# EAGLE design Sensor Board (EAGLE 6.4)

## Sheet 1 of 5: Microcontroller
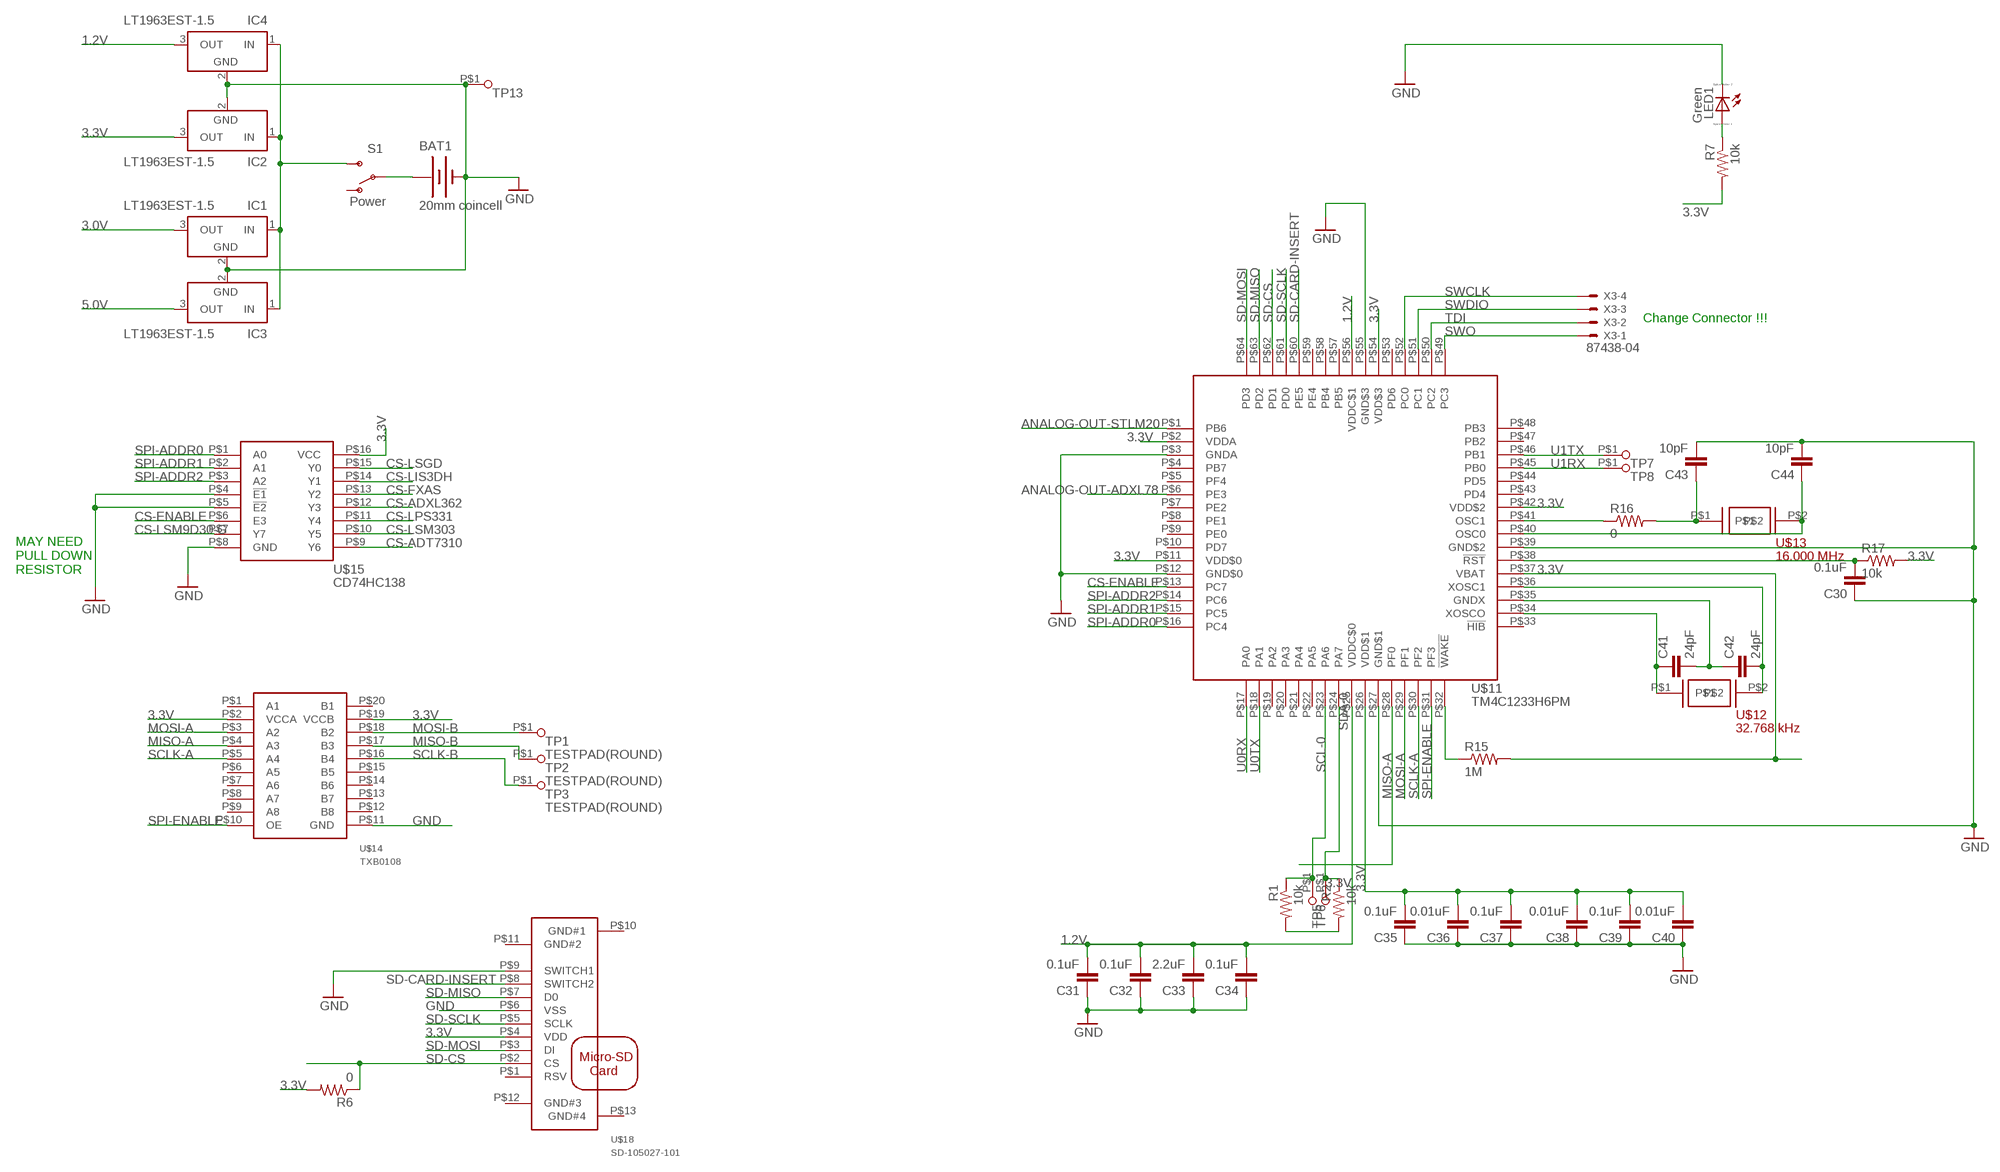
[diagram p0: schematic, sheet 1]

### Parts
BAT1  20mm coincell  BATTERY20MM_4LEGS  [BATTCON_20MM_4LEGS]
C30  0.1uF  CAP0603-CAP  [0603-CAP]
C31  0.1uF  CAP0603-CAP  [0603-CAP]
C32  0.1uF  CAP0603-CAP  [0603-CAP]
C33  2.2uF  CAP0603-CAP  [0603-CAP]
C34  0.1uF  CAP0603-CAP  [0603-CAP]
C35  0.1uF  CAP0603-CAP  [0603-CAP]
C36  0.01uF  CAP0603-CAP  [0603-CAP]
C37  0.1uF  CAP0603-CAP  [0603-CAP]
C38  0.01uF  CAP0603-CAP  [0603-CAP]
C39  0.1uF  CAP0603-CAP  [0603-CAP]
C40  0.01uF  CAP0603-CAP  [0603-CAP]
C41  24pF  CAP0603-CAP  [0603-CAP]
C42  24pF  CAP0603-CAP  [0603-CAP]
C43  10pF  CAP0603-CAP  [0603-CAP]
C44  10pF  CAP0603-CAP  [0603-CAP]
IC1  LT1963EST-1.5  [SOT223]
IC2  LT1963EST-1.5  [SOT223]
IC3  LT1963EST-1.5  [SOT223]
IC4  LT1963EST-1.5  [SOT223]
LED1  Green  LED_ESML0603  [LED_SML0603]
R1  10k  RESISTOR0603-RES  [0603-RES]
R2  10k  RESISTOR0603-RES  [0603-RES]
R6  0  RESISTOR0603-RES  [0603-RES]
R7  10k  RESISTOR0603-RES  [0603-RES]
R15  1M  RESISTOR0603-RES  [0603-RES]
R16  0  RESISTOR0603-RES  [0603-RES]
R17  10k  RESISTOR0603-RES  [0603-RES]
S1  Power  SWITCH-SPDT-SMD-A  [SWITCH-SPST-SMD-A]
TP1  TESTPAD(ROUND)  [TESTPAD(ROUND)]
TP2  TESTPAD(ROUND)  [TESTPAD(ROUND)]
TP3  TESTPAD(ROUND)  [TESTPAD(ROUND)]
TP5  TESTPAD(ROUND)  [TESTPAD(ROUND)]
TP6  TESTPAD(ROUND)  [TESTPAD(ROUND)]
TP7  TESTPAD(ROUND)  [TESTPAD(ROUND)]
TP8  TESTPAD(ROUND)  [TESTPAD(ROUND)]
TP13  TESTPAD(ROUND)  [TESTPAD(ROUND)]
U$11  TM4C1233H6PM  [S-PQFP-G64]
U$12  32.768 kHz  AB26TRB  [CYLINDRICAL-(1.9DIAX6L)]
U$13  16.000 MHz  NX5032GA  [2-SMD]
U$14  TXB0108  [TSSOP-(PW)-20]
U$15  CD74HC138  [SOIC-16]
U$18  SD-105027-101  [SD-105027-101]
X3  87438-04  [87438-04]

### Nets
1.2V: C31.2 C32.2 C33.2 C34.2 IC4.3(OUT) U$11.P$25(VDDC$0) U$11.P$56(VDDC$1)
3.0V: IC1.3(OUT) ; also sheet 2
3.3V: C35.2 C36.2 C37.2 C38.2 C39.2 C40.2 IC2.3(OUT) R1.2 R2.2 R6.2 R7.2 R15.2 R17.2 U$11.P$2(VDDA) U$11.P$11(VDD$0) U$11.P$26(VDD$1) U$11.P$37(VBAT) U$11.P$42(VDD$2) U$11.P$54(VDD$3) U$14.P$2(VCCA) U$14.P$19(VCCB) U$15.P$16(VCC) U$18.P$4(VDD) ; also sheet 2,3,4,5
5.0V: IC3.3(OUT) ; also sheet 5
ANALOG-OUT-ADXL78: U$11.P$6(PE3) ; also sheet 5
ANALOG-OUT-STLM20: U$11.P$1(PB6) ; also sheet 5
CS-ADT7310: U$15.P$9(Y6) ; also sheet 3
CS-ADXL362: U$15.P$12(Y3) ; also sheet 3
CS-ENABLE: U$11.P$13(PC7) U$15.P$6(E3)
CS-FXAS: U$15.P$13(Y2) ; also sheet 4
CS-LIS3DH: U$15.P$14(Y1) ; also sheet 2
CS-LPS331: U$15.P$11(Y4) ; also sheet 2
CS-LSGD: U$15.P$15(Y0) ; also sheet 2
CS-LSM9D30-G: U$15.P$7(Y7) ; also sheet 2
CS-LSM303: U$15.P$10(Y5) ; also sheet 2
GND: BAT1.2(-) C30.1 C31.1 C32.1 C33.1 C34.1 C35.1 C36.1 C37.1 C38.1 C39.1 C40.1 C43.2 C44.2 IC1.2(GND) IC2.2(GND) IC3.2(GND) IC4.2(GND) LED1.C TP13.P$1 U$11.P$3(GNDA) U$11.P$12(GND$0) U$11.P$27(GND$1) U$11.P$39(GND$2) U$11.P$55(GND$3) U$14.P$11(GND) U$15.P$4(!E1) U$15.P$5(!E2) U$15.P$8(GND) U$18.P$6(VSS) U$18.P$9(SWITCH1) ; also sheet 2,3,4,5
MISO-A: U$11.P$28(PF0) U$14.P$4(A3)
MISO-B: TP2.P$1 U$14.P$17(B3) ; also sheet 2,3,4
MOSI-A: U$11.P$29(PF1) U$14.P$3(A2)
MOSI-B: TP1.P$1 U$14.P$18(B2) ; also sheet 2,3,4
N$10: C30.2 R17.1 U$11.P$38(!RST)
N$11: C42.2 U$11.P$36(XOSC1) U$12.P$2
N$12: C41.1 U$11.P$34(XOSCO) U$12.P$1
N$13: C41.2 C42.1 U$11.P$35(GNDX)
N$14: C43.1 R16.2 U$13.P$1
N$16: C44.1 U$11.P$40(OSC0) U$13.P$2
N$17: R16.1 U$11.P$41(OSC1)
N$18: R15.1 U$11.P$32(!WAKE)
N$19: BAT1.1(+) S1.2(P)
N$23: IC1.1(IN) IC2.1(IN) IC3.1(IN) IC4.1(IN) S1.3(S)
N$27: LED1.A R7.1
SCL-0: R1.1 TP6.P$1 U$11.P$23(PA6) ; also sheet 4
SCLK-A: U$11.P$30(PF2) U$14.P$5(A4)
SCLK-B: TP3.P$1 U$14.P$16(B4) ; also sheet 2,3,4
SD-CARD-INSERT: U$11.P$60(PE5) U$18.P$8(SWITCH2)
SD-CS: R6.1 U$11.P$62(PD1) U$18.P$2(CS)
SD-MISO: U$11.P$63(PD2) U$18.P$7(D0)
SD-MOSI: U$11.P$64(PD3) U$18.P$3(DI)
SD-SCLK: U$11.P$61(PD0) U$18.P$5(SCLK)
SDA-0: R2.1 TP5.P$1 U$11.P$24(PA7) ; also sheet 4
SPI-ADDR0: U$11.P$16(PC4) U$15.P$1(A0)
SPI-ADDR1: U$11.P$15(PC5) U$15.P$2(A1)
SPI-ADDR2: U$11.P$14(PC6) U$15.P$3(A2)
SPI-ENABLE: U$11.P$31(PF3) U$14.P$10(OE)
SWCLK: U$11.P$52(PC0) X3.4
SWDIO: U$11.P$51(PC1) X3.3
SWO: U$11.P$49(PC3) X3.1
TDI: U$11.P$50(PC2) X3.2
U0RX: U$11.P$17(PA0)
U0TX: U$11.P$18(PA1)
U1RX: TP8.P$1 U$11.P$45(PB0)
U1TX: TP7.P$1 U$11.P$46(PB1)
Unconnected: S1.1(O) U$11.P$4(PB7) U$11.P$5(PF4) U$11.P$7(PE2) U$11.P$8(PE1) U$11.P$9(PE0) U$11.P$10(PD7) U$11.P$19(PA2) U$11.P$20(PA3) U$11.P$21(PA4) U$11.P$22(PA5) U$11.P$33(!HIB) U$11.P$43(PD4) U$11.P$44(PD5) U$11.P$47(PB2) U$11.P$48(PB3) U$11.P$53(PD6) U$11.P$57(PB5) U$11.P$58(PB4) U$11.P$59(PE4) U$14.P$1(A1) U$14.P$6(A5) U$14.P$7(A6) U$14.P$8(A7) U$14.P$9(A8) U$14.P$12(B8) U$14.P$13(B7) U$14.P$14(B6) U$14.P$15(B5) U$14.P$20(B1) U$18.P$1(RSV) U$18.P$10(GND#1) U$18.P$11(GND#2) U$18.P$12(GND#3) U$18.P$13(GND#4)

### Notes on the sheet
- Change Connector !!!
- MAY NEED
  PULL DOWN
  RESISTOR

## Sheet 2 of 5: STM - Sensors
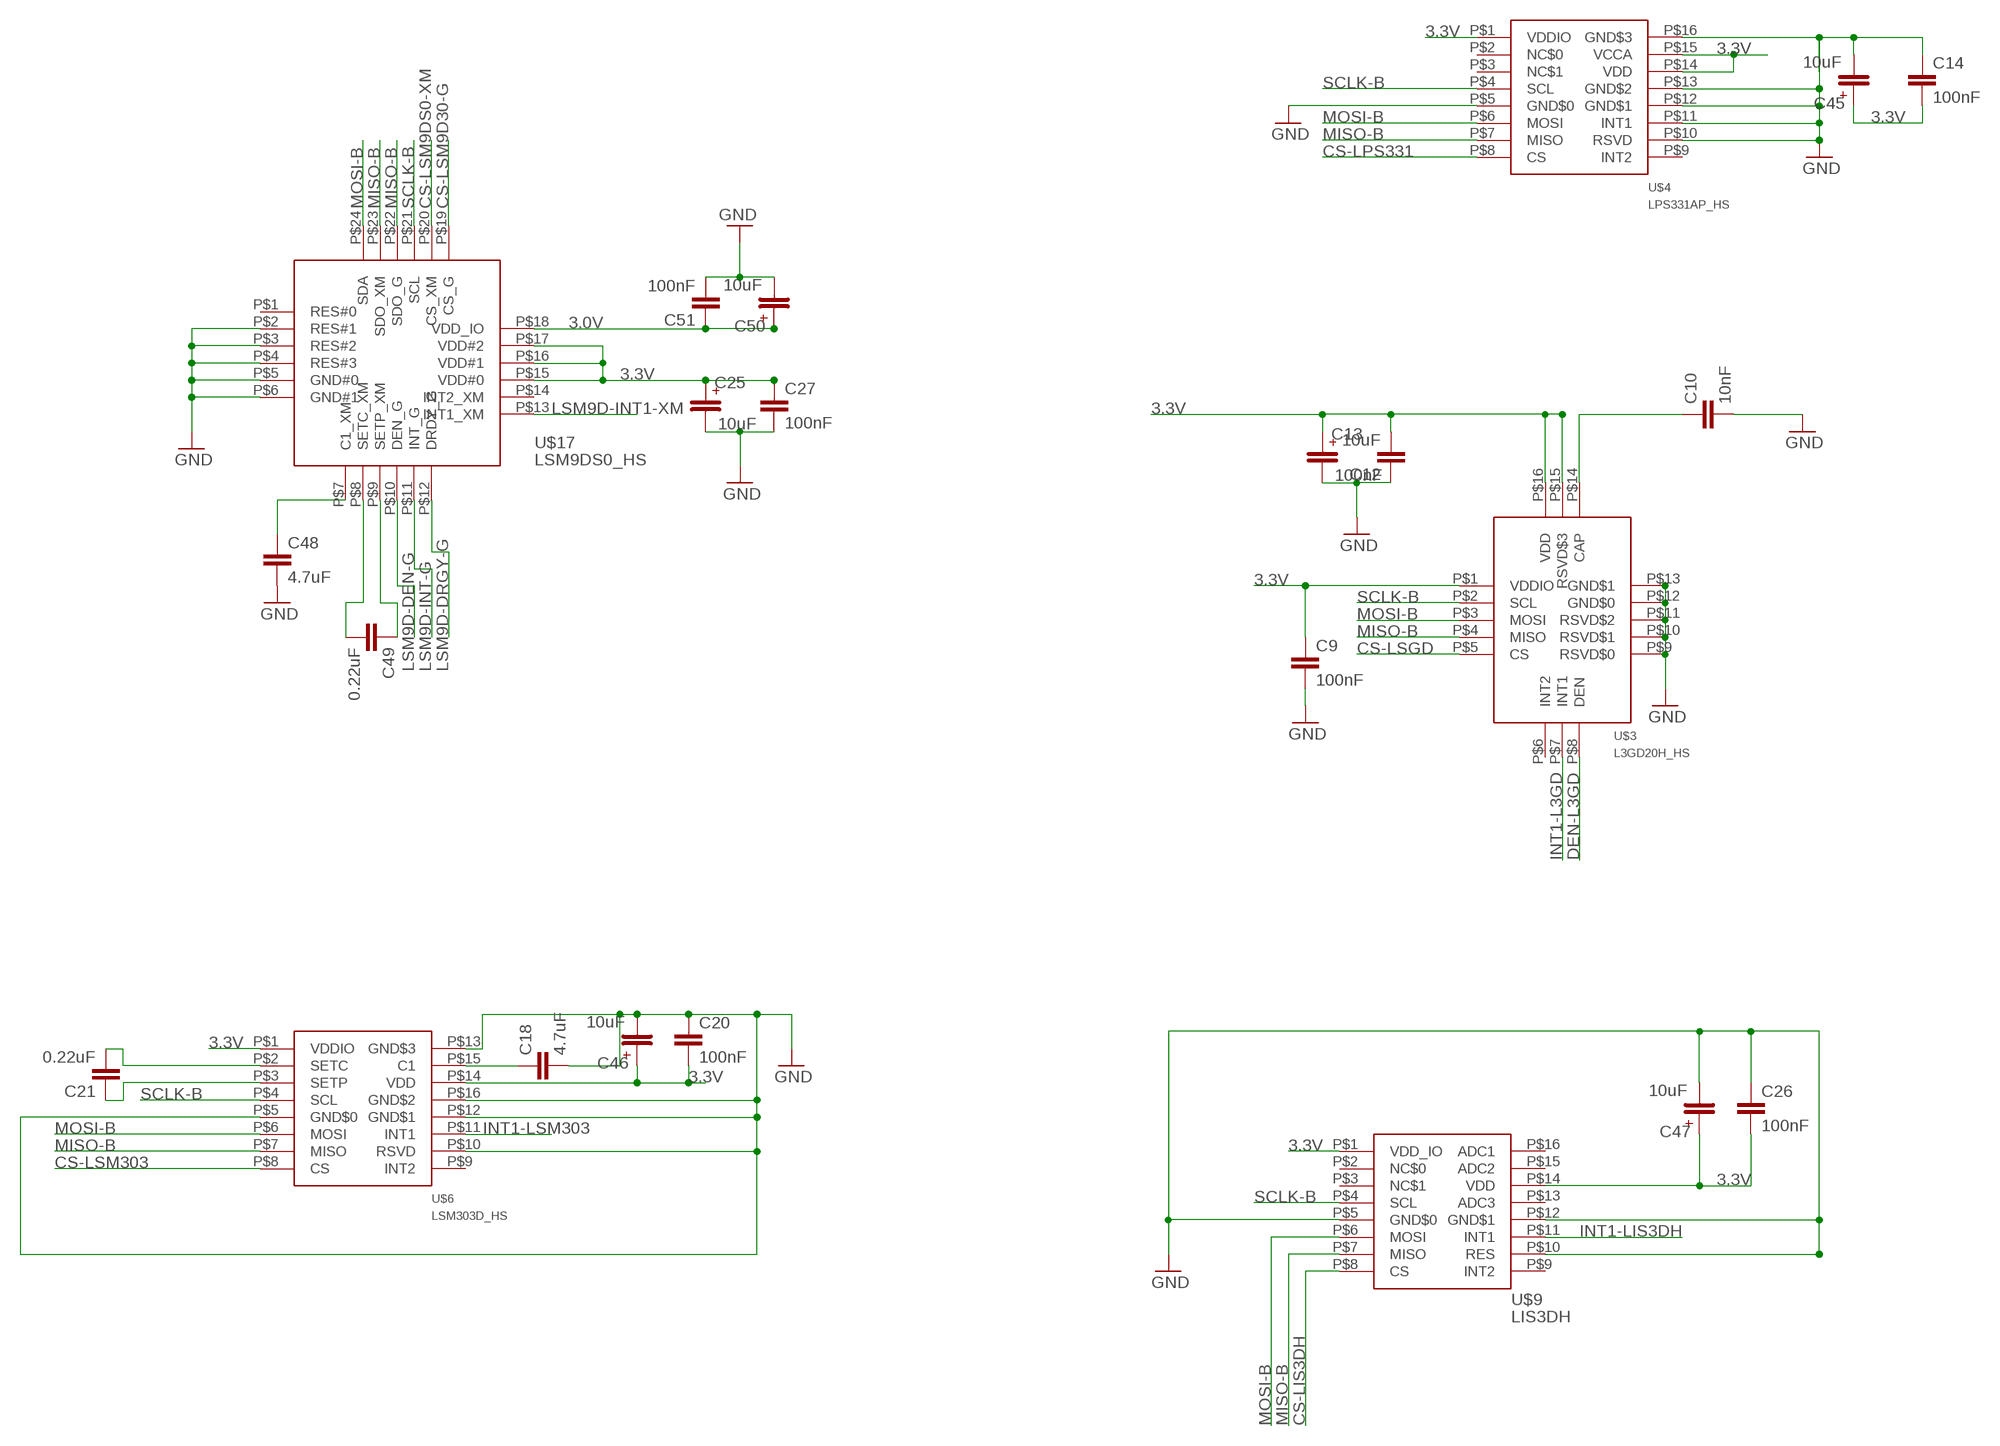
[diagram p1: schematic, sheet 2]

### Parts
C9  100nF  CAP0603-CAP  [0603-CAP]
C10  10nF  CAP0603-CAP  [0603-CAP]
C12  10uF  CAP0603-CAP  [0603-CAP]
C13  100nF  EEFCD0J100ER  [4.3X7.3SMD]
C14  100nF  CAP0603-CAP  [0603-CAP]
C18  4.7uF  CAP0603-CAP  [0603-CAP]
C20  100nF  CAP0603-CAP  [0603-CAP]
C21  0.22uF  CAP0603-CAP  [0603-CAP]
C25  10uF  EEFCD0J100ER  [4.3X7.3SMD]
C26  100nF  CAP0603-CAP  [0603-CAP]
C27  100nF  CAP0603-CAP  [0603-CAP]
C45  10uF  EEFCD0J100ER  [4.3X7.3SMD]
C46  10uF  EEFCD0J100ER  [4.3X7.3SMD]
C47  10uF  EEFCD0J100ER  [4.3X7.3SMD]
C48  4.7uF  CAP0603-CAP  [0603-CAP]
C49  0.22uF  CAP0603-CAP  [0603-CAP]
C50  10uF  EEFCD0J100ER  [4.3X7.3SMD]
C51  100nF  CAP0603-CAP  [0603-CAP]
U$3  L3GD20H_HS  [LGA-16(3X3)_HS]
U$4  LPS331AP_HS  [LGA-16(3X3)_HS]
U$6  LSM303D_HS  [LGA-16(3X3)_HS]
U$9  LIS3DH  LIS3DH_HS  [LGA-16(3X3)_HS]
U$17  LSM9DS0_HS  [LGA-24(4X4)_HS]

### Nets
3.0V: C50.P$1 C51.1 U$17.P$18(VDD_IO) ; also sheet 1
3.3V: C9.1 C12.2 C13.P$1 C14.2 C20.2 C25.P$1 C26.2 C27.1 C45.P$1 C46.P$1 C47.P$1 U$3.P$1(VDDIO) U$3.P$15(RSVD$3) U$3.P$16(VDD) U$4.P$1(VDDIO) U$4.P$14(VDD) U$4.P$15(VCCA) U$6.P$1(VDDIO) U$6.P$14(VDD) U$9.P$1(VDD_IO) U$9.P$14(VDD) U$17.P$15(VDD#0) U$17.P$16(VDD#1) U$17.P$17(VDD#2) ; also sheet 1,3,4,5
CS-LIS3DH: U$9.P$8(CS) ; also sheet 1
CS-LPS331: U$4.P$8(CS) ; also sheet 1
CS-LSGD: U$3.P$5(CS) ; also sheet 1
CS-LSM9D30-G: U$17.P$19(CS_G) ; also sheet 1
CS-LSM9DS0-XM: U$17.P$20(CS_XM)
CS-LSM303: U$6.P$8(CS) ; also sheet 1
DEN-L3GD: U$3.P$8(DEN)
GND: C9.2 C10.2 C12.1 C13.P$2 C14.1 C18.2 C20.1 C25.P$2 C26.1 C27.2 C45.P$2 C46.P$2 C47.P$2 C48.2 C50.P$2 C51.2 U$3.P$9(RSVD$0) U$3.P$10(RSVD$1) U$3.P$11(RSVD$2) U$3.P$12(GND$0) U$3.P$13(GND$1) U$4.P$5(GND$0) U$4.P$10(RSVD) U$4.P$11(INT1) U$4.P$12(GND$1) U$4.P$13(GND$2) U$4.P$16(GND$3) U$6.P$5(GND$0) U$6.P$10(RSVD) U$6.P$12(GND$1) U$6.P$13(GND$3) U$6.P$16(GND$2) U$9.P$5(GND$0) U$9.P$10(RES) U$9.P$12(GND$1) U$17.P$2(RES#1) U$17.P$3(RES#2) U$17.P$4(RES#3) U$17.P$5(GND#0) U$17.P$6(GND#1) ; also sheet 1,3,4,5
INT1-L3GD: U$3.P$7(INT1)
INT1-LIS3DH: U$9.P$11(INT1)
INT1-LSM303: U$6.P$11(INT1)
LSM9D-DEN-G: U$17.P$10(DEN_G)
LSM9D-DRGY-G: U$17.P$12(DRDY_G)
LSM9D-INT1-XM: U$17.P$13(INT1_XM)
LSM9D-INT-G: U$17.P$11(INT_G)
MISO-B: U$3.P$4(MISO) U$4.P$7(MISO) U$6.P$7(MISO) U$9.P$7(MISO) U$17.P$22(SDO_G) U$17.P$23(SDO_XM) ; also sheet 1,3,4
MOSI-B: U$3.P$3(MOSI) U$4.P$6(MOSI) U$6.P$6(MOSI) U$9.P$6(MOSI) U$17.P$24(SDA) ; also sheet 1,3,4
N$4: C10.1 U$3.P$14(CAP)
N$6: C18.1 U$6.P$15(C1)
N$7: C21.2 U$6.P$2(SETC)
N$8: C48.1 U$17.P$7(C1_XM)
N$15: C21.1 U$6.P$3(SETP)
N$21: C49.2 U$17.P$8(SETC_XM)
N$22: C49.1 U$17.P$9(SETP_XM)
SCLK-B: U$3.P$2(SCL) U$4.P$4(SCL) U$6.P$4(SCL) U$9.P$4(SCL) U$17.P$21(SCL) ; also sheet 1,3,4
Unconnected: U$3.P$6(INT2) U$4.P$2(NC$0) U$4.P$3(NC$1) U$4.P$9(INT2) U$6.P$9(INT2) U$9.P$2(NC$0) U$9.P$3(NC$1) U$9.P$9(INT2) U$9.P$13(ADC3) U$9.P$15(ADC2) U$9.P$16(ADC1) U$17.P$1(RES#0) U$17.P$14(INT2_XM)

## Sheet 3 of 5: ADXL - Sensors
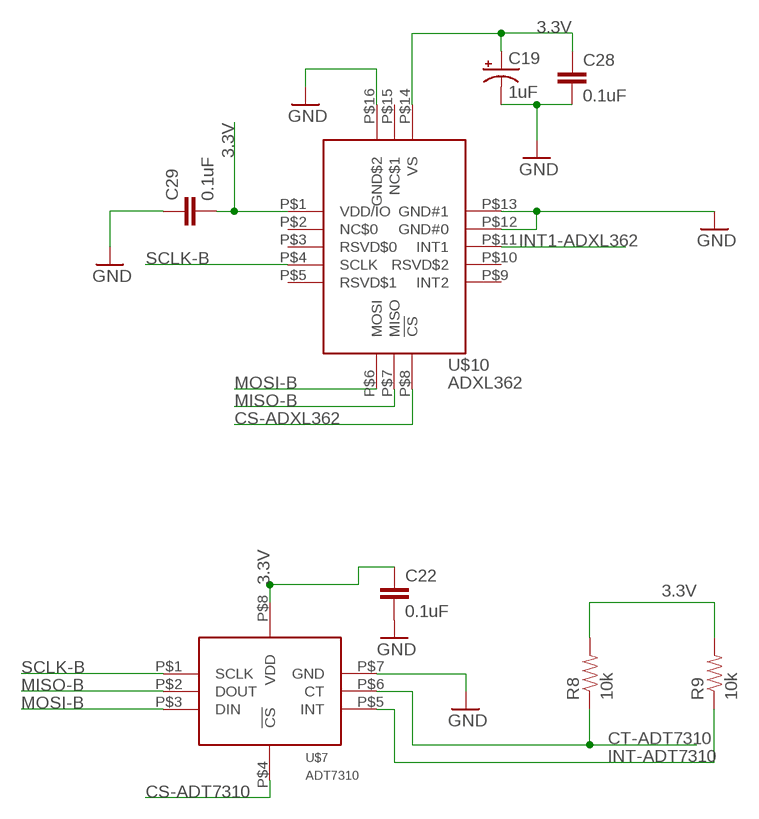
[diagram p2: schematic, sheet 3]

### Parts
C19  1uF  CAP_POL6032  [EIA6032]
C22  0.1uF  CAP0603-CAP  [0603-CAP]
C28  0.1uF  CAP0603-CAP  [0603-CAP]
C29  0.1uF  CAP0603-CAP  [0603-CAP]
R8  10k  RESISTOR0603-RES  [0603-RES]
R9  10k  RESISTOR0603-RES  [0603-RES]
U$7  ADT7310  [SOIC-8(5X6.2)]
U$10  ADXL362  ADXL362_HS  [LGA-16(3X3.25)_HS]

### Nets
3.3V: C19.P$1(+) C22.1 C28.1 C29.2 R8.2 R9.2 U$7.P$8(VDD) U$10.P$1(VDD/IO) U$10.P$14(VS) ; also sheet 1,2,4,5
CS-ADT7310: U$7.P$4(!CS) ; also sheet 1
CS-ADXL362: U$10.P$8(!CS) ; also sheet 1
CT-ADT7310: R8.1 U$7.P$6(CT)
GND: C19.P$2(-) C22.2 C28.2 C29.1 U$7.P$7(GND) U$10.P$12(GND#0) U$10.P$13(GND#1) U$10.P$16(GND$2) ; also sheet 1,2,4,5
INT1-ADXL362: U$10.P$11(INT1)
INT-ADT7310: R9.1 U$7.P$5(INT)
MISO-B: U$7.P$2(DOUT) U$10.P$7(MISO) ; also sheet 1,2,4
MOSI-B: U$7.P$3(DIN) U$10.P$6(MOSI) ; also sheet 1,2,4
SCLK-B: U$7.P$1(SCLK) U$10.P$4(SCLK) ; also sheet 1,2,4
Unconnected: U$10.P$2(NC$0) U$10.P$3(RSVD$0) U$10.P$5(RSVD$1) U$10.P$9(INT2) U$10.P$10(RSVD$2) U$10.P$15(NC$1)

## Sheet 4 of 5: Freescale - Sensors
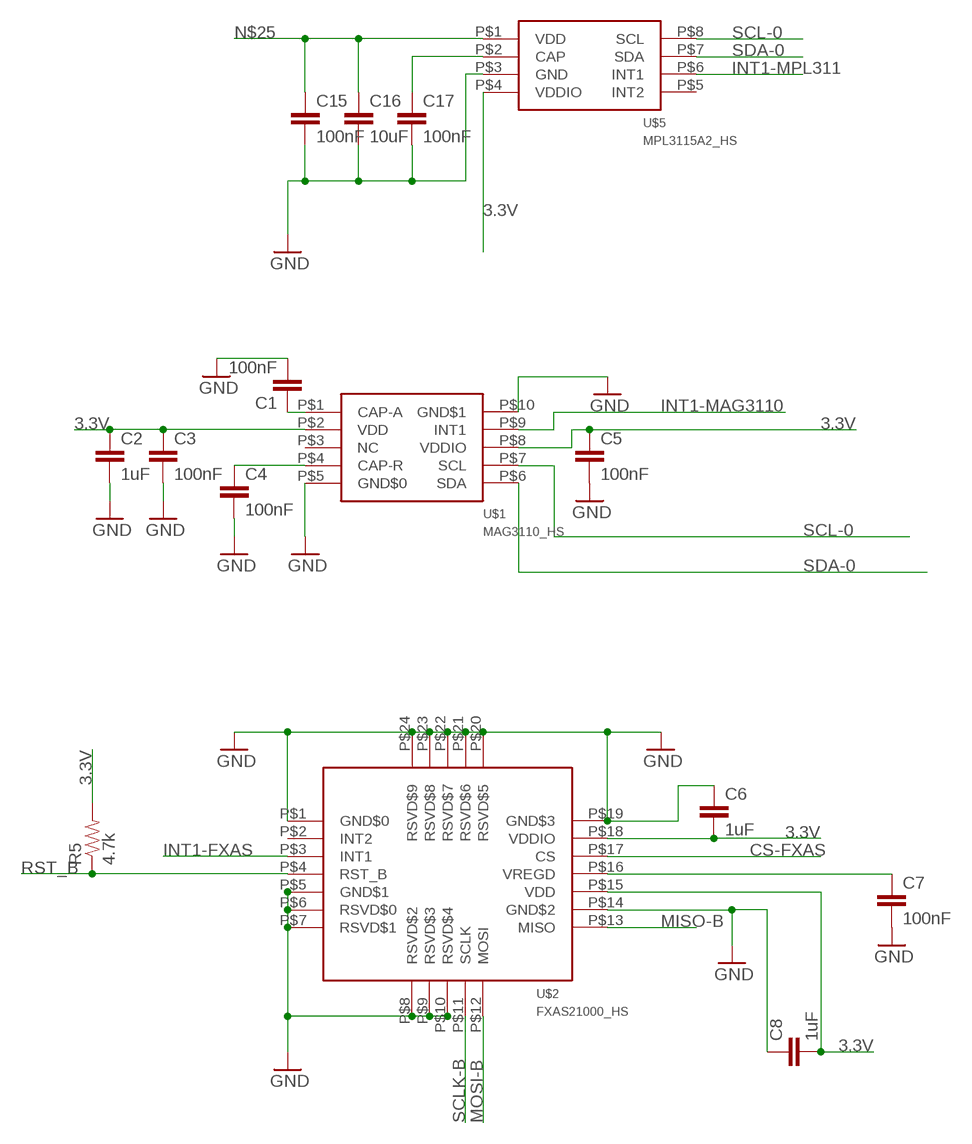
[diagram p3: schematic, sheet 4]

### Parts
C1  100nF  CAP0603-CAP  [0603-CAP]
C2  1uF  CAP0603-CAP  [0603-CAP]
C3  100nF  CAP0603-CAP  [0603-CAP]
C4  100nF  CAP0603-CAP  [0603-CAP]
C5  100nF  CAP0603-CAP  [0603-CAP]
C6  1uF  CAP0603-CAP  [0603-CAP]
C7  100nF  CAP0603-CAP  [0603-CAP]
C8  1uF  CAP0603-CAP  [0603-CAP]
C15  100nF  CAP0603-CAP  [0603-CAP]
C16  10uF  CAP0603-CAP  [0603-CAP]
C17  100nF  CAP0603-CAP  [0603-CAP]
R5  4.7k  RESISTOR0603-RES  [0603-RES]
U$1  MAG3110_HS  [DFN-10(2X2)_HS]
U$2  FXAS21000_HS  [QFN-24(4X4)_HS]
U$5  MPL3115A2_HS  [LGA-8(5X3)_HS]

### Nets
3.3V: C2.1 C3.1 C5.1 C6.2 C8.2 R5.2 U$1.P$2(VDD) U$1.P$8(VDDIO) U$2.P$15(VDD) U$2.P$18(VDDIO) U$5.P$4(VDDIO) ; also sheet 1,2,3,5
CS-FXAS: U$2.P$17(CS) ; also sheet 1
GND: C1.2 C2.2 C3.2 C4.2 C5.2 C6.1 C7.2 C8.1 C15.2 C16.2 C17.2 U$1.P$5(GND$0) U$1.P$10(GND$1) U$2.P$1(GND$0) U$2.P$5(GND$1) U$2.P$6(RSVD$0) U$2.P$7(RSVD$1) U$2.P$8(RSVD$2) U$2.P$9(RSVD$3) U$2.P$10(RSVD$4) U$2.P$14(GND$2) U$2.P$19(GND$3) U$2.P$20(RSVD$5) U$2.P$21(RSVD$6) U$2.P$22(RSVD$7) U$2.P$23(RSVD$8) U$2.P$24(RSVD$9) U$5.P$3(GND) ; also sheet 1,2,3,5
INT1-FXAS: U$2.P$3(INT1)
INT1-MAG3110: U$1.P$9(INT1)
INT1-MPL311: U$5.P$6(INT1)
MISO-B: U$2.P$13(MISO) ; also sheet 1,2,3
MOSI-B: U$2.P$12(MOSI) ; also sheet 1,2,3
N$1: C1.1 U$1.P$1(CAP-A)
N$2: C7.1 U$2.P$16(VREGD)
N$3: C4.1 U$1.P$4(CAP-R)
N$5: C17.1 U$5.P$2(CAP)
N$25: C15.1 C16.1 U$5.P$1(VDD)
RST_B: R5.1 U$2.P$4(RST_B)
SCL-0: U$1.P$7(SCL) U$5.P$8(SCL) ; also sheet 1
SCLK-B: U$2.P$11(SCLK) ; also sheet 1,2,3
SDA-0: U$1.P$6(SDA) U$5.P$7(SDA) ; also sheet 1
Unconnected: U$1.P$3(NC) U$2.P$2(INT2) U$5.P$5(INT2)

## Sheet 5 of 5: Analog - Sensors
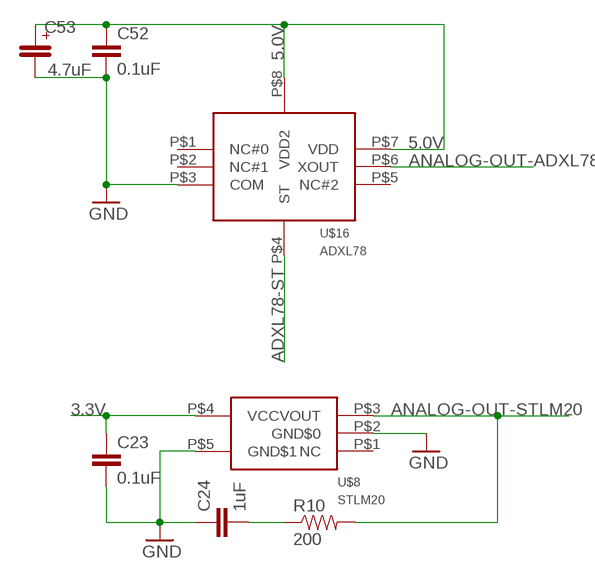
[diagram p4: schematic, sheet 5]

### Parts
C23  0.1uF  CAP0603-CAP  [0603-CAP]
C24  1uF  CAP0603-CAP  [0603-CAP]
C52  0.1uF  CAP0603-CAP  [0603-CAP]
C53  4.7uF  EEFCD0J100ER  [4.3X7.3SMD]
R10  200  RESISTOR0603-RES  [0603-RES]
U$8  STLM20  [SOT323-5L]
U$16  ADXL78  [LCC-8(5X5)_HS]

### Nets
3.3V: C23.1 U$8.P$4(VCC) ; also sheet 1,2,3,4
5.0V: C52.1 C53.P$1 U$16.P$7(VDD) U$16.P$8(VDD2) ; also sheet 1
ADXL78-ST: U$16.P$4(ST)
ANALOG-OUT-ADXL78: U$16.P$6(XOUT) ; also sheet 1
ANALOG-OUT-STLM20: R10.2 U$8.P$3(VOUT) ; also sheet 1
GND: C23.2 C24.1 C52.2 C53.P$2 U$8.P$2(GND$0) U$8.P$5(GND$1) U$16.P$3(COM) ; also sheet 1,2,3,4
N$9: C24.2 R10.1
Unconnected: U$8.P$1(NC) U$16.P$1(NC#0) U$16.P$2(NC#1) U$16.P$5(NC#2)

## Power pins joined to a net without a drawn wire
GND: IC1.4(GND) IC2.4(GND) IC3.4(GND) IC4.4(GND)

## Library data of the parts
BAT1 = SparkFun-Electromechanical:BATTERY: Battery Holders Various common sizes : AA, AAA, 20mm coin cell and 12mm coin cell. 20MM_4LEGS, BATT-10373; PROD_ID: BATT-10373
C1-C10 C12 C14-C18 C20-C24 C26-C44 C48 C49 C51 C52 = SparkFun-Passives:CAP: Capacitor Standard 0603 ceramic capacitor, and 0.1" leaded capacitor.
C13 C25 C45-C47 C50 C53 = Kas-Passives:EEFCD0J100ER: ALU Capacitor
C19 = SparkFun-Passives:CAP_POL: Capacitor Polarized These are standard SMD and PTH capacitors. Normally 10uF, 47uF, and 100uF in electrolytic and tantalum varieties. Always verify the external diameter of the through hole cap, it varies with capacity, voltage, and manufacturer. The EIA devices should be standard.
IC1-IC4 = linear-technology:LT1963EST: 1.5A, Low Noise, Fast Transient Response LDO Regulator Source: http://www.linear.com/pc/downloadDocument.do?navId=H0,C3,P2222,D3148; MPN: LT1963EST-1.5; OC_FARNELL: 1663528; OC_NEWARK: 57M7534
LED1 = eagle-ltspice:LED_E: LED Source: http://www.osram.convergy.de Source: www.luxeon.com Source: www.kingbright.com; SPICEMODEL: NONE; SPICEPREFIX: D; SPICETYPE: diode
R1 R2 R5-R10 R15-R17 = SparkFun-Passives:RESISTOR: Resistor Basic schematic elements and footprints for 0603, 1206, and PTH resistors.
S1 = SparkFun-Electromechanical:SWITCH-SPDT: SPDT Switch Simple slide switch, Spark Fun Electronics SKU : COM-00102 DPDT SMT slide switch, AYZ0202, SWCH-08179
TP1-TP3 TP5-TP8 TP13 = Kas-Passives:TESTPAD(ROUND)
U$1 = Kas-Sensors:MAG3110: MAG3110 in a 2x2 DFN-10 package
U$2 = Kas-Sensors:FXAS21000: FXAS21000 in a 4x4 QFN-24 package
U$3 = Kas-Sensors:L3GD20H: L3GD20H in a 3x3 LGA-16 package
U$4 = Kas-Sensors:LPS331AP: LPS331AP in a 3x3 HCLGA-16 package
U$5 = Kas-Sensors:MPL3115A2: MPL3115A2 in a 3x5 LGA-8 package
U$6 = Kas-Sensors:LSM303D: LSM303D in a 3x3 LGA-16 package
U$7 = Kas-Sensors:ADT7310: ADT7310 in a 5x6.2 SOIC-8 package
U$8 = Kas-Sensors:STLM20: STLM20 in a 1.35x2.2 SOT323-5L package
U$9 = Kas-Sensors:LIS3DH: LIS3DH in a 3x3 LGA-16 package
U$10 = Kas-Sensors:ADXL362: ADXL362 in a 3x3.25 LGA-16 Package
U$11 = Kas-Microcontroller:TM4C1233H6PM: TM4C1233H6PM in a 10.2x10.2 S-PQFP-G64 package
U$12 = Kas-Crystal:AB26TRB: AB26TRB in a cylindrical (1.90mm x 6.00mm) package AB26TRB-32.768KHZ
U$13 = Kas-Crystal:NX5032GA: NX5032GA in a 2-SMD (5mmx3.2mm) package
U$14 = Kas-Buffers & Level Shifters:TXB0108
U$15 = Kas-Buffers & Level Shifters:CD74HC138
U$16 = Kas-Sensors:ADXL78: ADXL78 in a 5x5 LCC-8 package
U$17 = Kas-Sensors:LSM9DS0
U$18 = Kas-Connectors:SD-105027-101
X3 = con-molex:87438-04: Wire-to-Board 1.50mm (.059") Pitch Header - Right Angle, SMT, Shrouded Source: http://www.molex.com/product/micro/87438.html; OC_FARNELL: unknown; OC_NEWARK: unknown

## Board
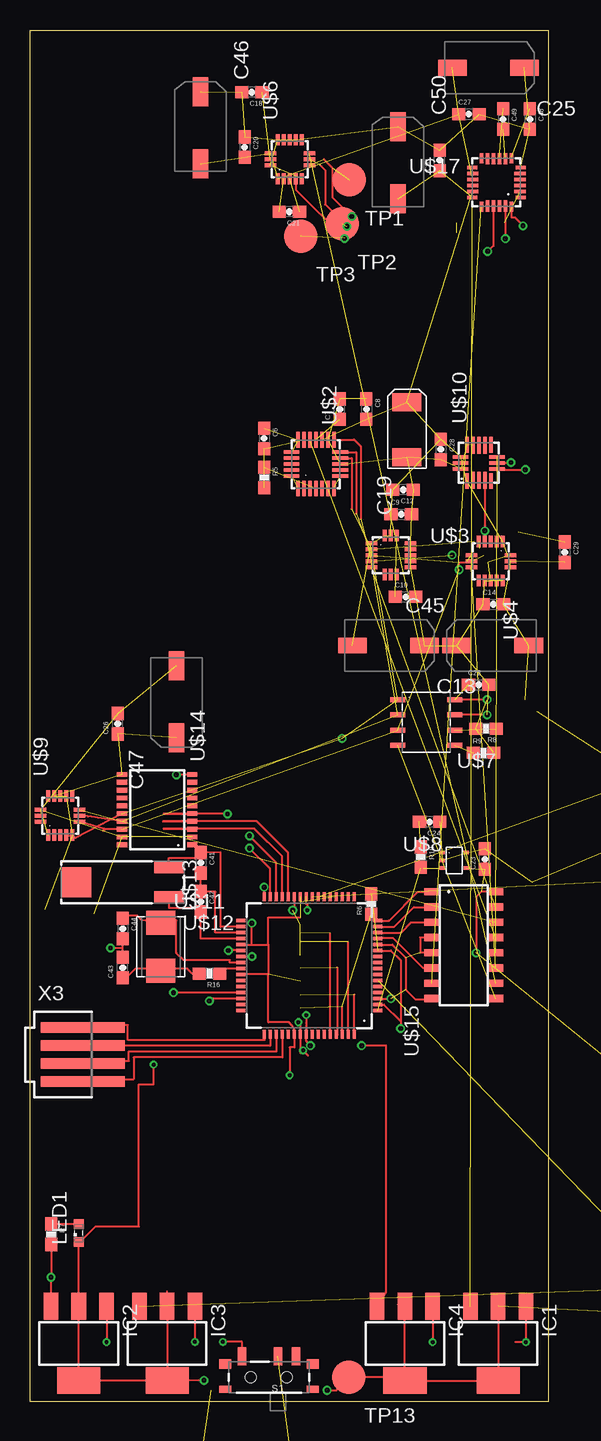
[diagram p5: board, top side]
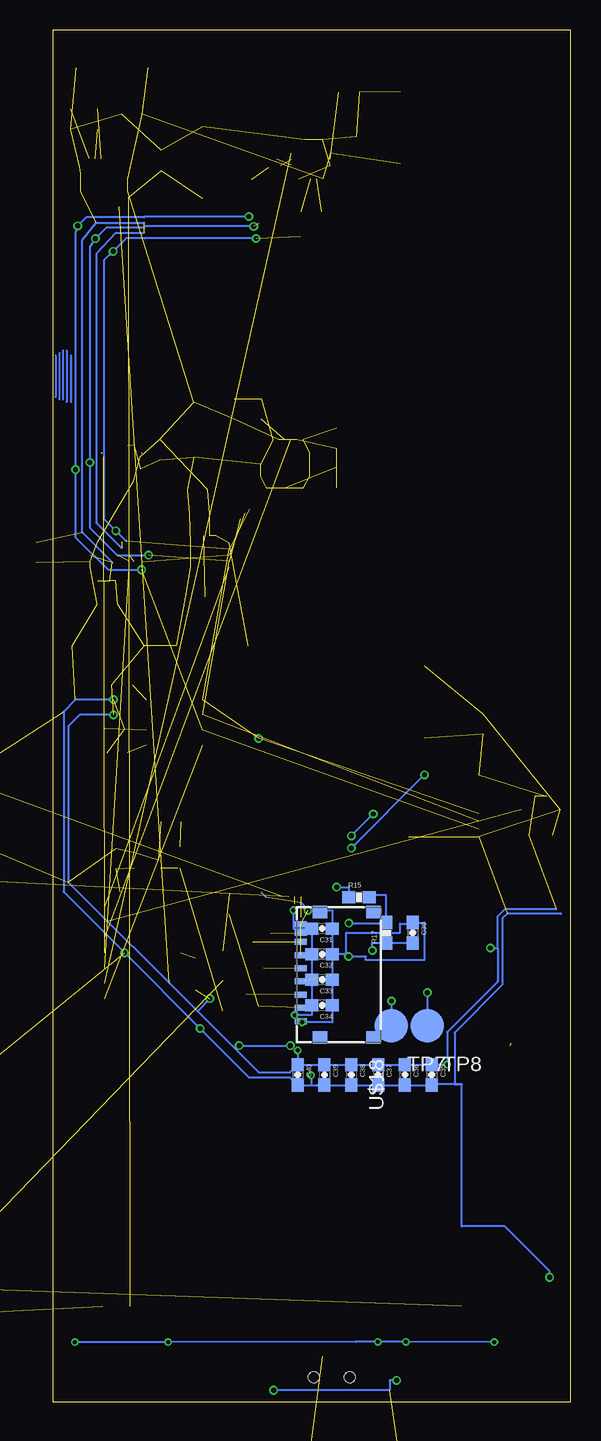
[diagram p6: board, bottom side, seen from below]

Size 43.18 x 114.3 mm. Coordinates in mm from the lower left corner, seen from the top.
Outline: 43.18,0 0,0 0,114.3 43.18,114.3 43.18,0
Copper layers (1*2*15*16): Top 0.035mm / dielectric 0.2mm / layer 2 0.0175mm / dielectric 1.1mm / layer 15 0.0175mm / dielectric 0.2mm / Bottom 0.035mm
Design rules "SeeedStudio_DRU_no_angle_20130527": minimum track width 6mil, minimum drill 12mil, track to track 6mil, track to pad 6mil, pad to pad 6mil, via to via 6mil, smd to smd 0mil, copper to edge 10mil, drill to drill 10mil, minimum pad ring 6mil, minimum via ring 6mil, stop-mask expansion 2mil, vias tented up to drill 25mil, thermal gap 10mil

### Footprints (pad centres in the part's own frame; a part is rotated, then mirrored left to right if it is on the bottom)
BATTCON_20MM_4LEGS = smd 1.778 x 2.54: 1 -11,1.55; 3 11,1.55; P$1 -11,-1.55; P$2 11,-1.55 | smd 13 x 8: 2 0,0
0603-CAP = smd 1.1 x 1: 1 -0.85,0; 2 0.85,0
4.3X7.3SMD = smd 2.4 x 1.3: P$1 -3,0; P$2 3,0
EIA6032 = smd 1.5 x 2.4: P$1 -2.3,0; P$2 2.3,0
SOT223 = smd 1.219 x 2.235: 1 -2.311,-3.099; 2 0,-3.099; 3 2.311,-3.099 | smd 3.6 x 2.2: 4 0,3.099
LED_SML0603 = smd 0.8 x 0.8: A 0.75,0; C -0.75,0
0603-RES = smd 1.1 x 1: 1 -0.85,0; 2 0.85,0
SWITCH-SPST-SMD-A = smd 0.7 x 1.5: 1 -2.25,-1.75; 2 -0.75,-1.75; 3 2.25,-1.75 | smd 1 x 0.6: GND1 -3.65,1; GND3 3.65,1 | smd 1 x 0.8: GND2 -3.65,-1.1; GND4 3.65,-1.1 | hole 0.9: -1.5,0; 1.5,0
TESTPAD(ROUND) = smd 2.794 x 2.794: P$1 0,0
DFN-10(2X2)_HS = smd 1.1 x 0.225: P$1 -1.15,0.8; P$2 -1.15,0.4; P$3 -1.15,0; P$4 -1.15,-0.4; P$5 -1.15,-0.8; P$6 1.15,-0.8; P$7 1.15,-0.4; P$8 1.15,0; P$9 1.15,0.4; P$10 1.15,0.8
QFN-24(4X4)_HS = smd 1.3 x 0.3: P$1 -2.025,1.5; P$2 -2.025,1; P$3 -2.025,0.5; P$4 -2.025,0; P$5 -2.025,-0.5; P$6 -2.025,-1; P$7 -2.025,-1.5; P$13 2.025,-1.5; P$14 2.025,-1; P$15 2.025,-0.5; P$16 2.025,0; P$17 2.025,0.5; P$18 2.025,1; P$19 2.025,1.5 | smd 0.3 x 1.3: P$8 -1,-2.025; P$9 -0.5,-2.025; P$10 0,-2.025; P$11 0.5,-2.025; P$12 1,-2.025; P$20 1,2.025; P$21 0.5,2.025; P$22 0,2.025; P$23 -0.5,2.025; P$24 -1,2.025
LGA-16(3X3)_HS = smd 0.95 x 0.34: P$1 -1.625,1; P$2 -1.625,0.5; P$3 -1.625,0; P$4 -1.625,-0.5; P$5 -1.625,-1; P$9 1.625,-1; P$10 1.625,-0.5; P$11 1.625,0; P$12 1.625,0.5; P$13 1.625,1 | smd 0.34 x 0.95: P$6 -0.5,-1.625; P$7 0,-1.625; P$8 0.5,-1.625; P$14 0.5,1.625; P$15 0,1.625; P$16 -0.5,1.625
LGA-8(5X3)_HS = smd 0.55 x 1.55: P$1 -1.875,-1.325; P$2 -0.625,-1.325; P$3 0.625,-1.325; P$4 1.875,-1.325; P$5 1.875,1.325; P$6 0.625,1.325; P$7 -0.625,1.325; P$8 -1.875,1.325
SOIC-8(5X6.2) = smd 1.27 x 0.41: P$1 -2.365,1.905; P$2 -2.365,0.635; P$3 -2.365,-0.635; P$4 -2.365,-1.905; P$5 2.365,-1.905; P$6 2.365,-0.635; P$7 2.365,0.635; P$8 2.365,1.905
SOT323-5L = smd 0.4 x 0.3: P$1 1,-0.65; P$2 1,0; P$3 1,0.65; P$4 -1,0.65; P$5 -1,-0.65
LGA-16(3X3.25)_HS = smd 1.32 x 0.3: P$1 -1.513,1; P$5 -1.513,-1; P$9 1.513,-1; P$13 1.513,1 | smd 1.425 x 0.3: P$2 -1.462,0.5; P$3 -1.462,0; P$4 -1.462,-0.5; P$10 1.462,-0.5; P$11 1.462,0; P$12 1.462,0.5 | smd 0.3 x 1.3: P$6 -0.5,-1.525; P$7 0,-1.525; P$8 0.5,-1.525; P$14 0.5,1.525; P$15 0,1.525; P$16 -0.5,1.525
S-PQFP-G64 = smd 0.75 x 0.27: P$1 -5.725,3.75; P$2 -5.725,3.25; P$3 -5.725,2.75; P$4 -5.725,2.25; P$5 -5.725,1.75; P$6 -5.725,1.25; P$7 -5.725,0.75; P$8 -5.725,0.25; P$9 -5.725,-0.25; P$10 -5.725,-0.75; P$11 -5.725,-1.25; P$12 -5.725,-1.75; P$13 -5.725,-2.25; P$14 -5.725,-2.75; P$15 -5.725,-3.25; P$16 -5.725,-3.75; P$33 5.725,-3.75; P$34 5.725,-3.25; P$35 5.725,-2.75; P$36 5.725,-2.25; P$37 5.725,-1.75; P$38 5.725,-1.25; P$39 5.725,-0.75; P$40 5.725,-0.25; P$41 5.725,0.25; P$42 5.725,0.75; P$43 5.725,1.25; P$44 5.725,1.75; P$45 5.725,2.25; P$46 5.725,2.75; P$47 5.725,3.25; P$48 5.725,3.75 | smd 0.27 x 0.75: P$17 -3.75,-5.725; P$18 -3.25,-5.725; P$19 -2.75,-5.725; P$20 -2.25,-5.725; P$21 -1.75,-5.725; P$22 -1.25,-5.725; P$23 -0.75,-5.725; P$24 -0.25,-5.725; P$25 0.25,-5.725; P$26 0.75,-5.725; P$27 1.25,-5.725; P$28 1.75,-5.725; P$29 2.25,-5.725; P$30 2.75,-5.725; P$31 3.25,-5.725; P$32 3.75,-5.725; P$49 3.75,5.725; P$50 3.25,5.725; P$51 2.75,5.725; P$52 2.25,5.725; P$53 1.75,5.725; P$54 1.25,5.725; P$55 0.75,5.725; P$56 0.25,5.725; P$57 -0.25,5.725; P$58 -0.75,5.725; P$59 -1.25,5.725; P$60 -1.75,5.725; P$61 -2.25,5.725; P$62 -2.75,5.725; P$63 -3.25,5.725; P$64 -3.75,5.725
CYLINDRICAL-(1.9DIAX6L) = smd 2.5 x 1: P$1 3.875,1.25; P$2 3.875,-1.25 | smd 2.5 x 2.5: P$3 -3.875,0
2-SMD = smd 2 x 2.4: P$1 -2,0; P$2 2,0
TSSOP-(PW)-20 = smd 0.4 x 0.85: P$1 -2.925,-2.925; P$2 -2.275,-2.925; P$3 -1.625,-2.925; P$4 -0.975,-2.925; P$5 -0.325,-2.925; P$6 0.325,-2.925; P$7 0.975,-2.925; P$8 1.625,-2.925; P$9 2.275,-2.925; P$10 2.925,-2.925; P$11 2.925,2.925; P$12 2.275,2.925; P$13 1.625,2.925; P$14 0.975,2.925; P$15 0.325,2.925; P$16 -0.325,2.925; P$17 -0.975,2.925; P$18 -1.625,2.925; P$19 -2.275,2.925; P$20 -2.925,2.925
SOIC-16 = smd 0.6 x 1.27: P$1 -4.445,-2.675; P$2 -3.175,-2.675; P$3 -1.905,-2.675; P$4 -0.635,-2.675; P$5 0.635,-2.675; P$6 1.905,-2.675; P$7 3.175,-2.675; P$8 4.445,-2.675; P$9 4.445,2.675; P$10 3.175,2.675; P$11 1.905,2.675; P$12 0.635,2.675; P$13 -0.635,2.675; P$14 -1.905,2.675; P$15 -3.175,2.675; P$16 -4.445,2.675
LCC-8(5X5)_HS = smd 1.87 x 0.735: P$1 -2.117,1.27; P$2 -2.117,0; P$3 -2.117,-1.27; P$5 2.117,-1.27; P$6 2.117,0; P$7 2.117,1.27 | smd 0.735 x 1.87: P$4 0,-2.117; P$8 0,2.117
LGA-24(4X4)_HS = smd 0.85 x 0.3: P$1 -2.025,1.25; P$6 -2.025,-1.25; P$13 2.025,-1.25; P$18 2.025,1.25 | smd 0.95 x 0.3: P$2 -1.975,0.75; P$3 -1.975,0.25; P$4 -1.975,-0.25; P$5 -1.975,-0.75; P$14 1.975,-0.75; P$15 1.975,-0.25; P$16 1.975,0.25; P$17 1.975,0.75 | smd 0.3 x 0.85: P$7 -1.25,-2.025; P$12 1.25,-2.025; P$19 1.25,2.025; P$24 -1.25,2.025 | smd 0.3 x 0.95: P$8 -0.75,-1.975; P$9 -0.25,-1.975; P$10 0.25,-1.975; P$11 0.75,-1.975; P$20 0.75,1.975; P$21 0.25,1.975; P$22 -0.25,1.975; P$23 -0.75,1.975
SD-105027-101 = smd 0.5 x 1: P$1 3.85,-6.66; P$2 2.75,-6.66; P$3 1.65,-6.66; P$4 0.55,-6.66; P$5 -0.55,-6.66; P$6 -1.65,-6.66; P$7 -2.75,-6.66; P$8 -3.51,-6.66; P$9 -4.21,-6.66 | smd 1.05 x 1.2: P$10 -5.225,-0.6; P$11 -5.225,-5.05; P$12 5.225,-5.05; P$13 5.225,-0.6
87438-04 = smd 7 x 0.85: 1 0,2.25; 2 0,0.75; 3 0,-0.75; 4 0,-2.25

### Placement (x,y rotation side)
BAT1  12.55,-16.46 180 top  (outside the outline)
C1  55.12,53.4 90 top  (outside the outline)
C2  56.08,49.17 270 top  (outside the outline)
C3  53.85,49.17 270 top  (outside the outline)
C4  58.32,49.17 270 top  (outside the outline)
C5  57.45,57.12 180 bottom  (outside the outline)
C6  19.51,80.26 270 top
C7  25.81,82.7 90 top
C8  28.04,82.7 270 top
C9  30.94,73.94 0 top
C10  31.29,67.06 0 top
C12  31.09,76 180 top
C13  29.87,62.99 0 top
C14  38.61,66.45 0 top
C15  58.6,25.84 90 top  (outside the outline)
C16  56.39,25.84 90 top  (outside the outline)
C17  54.19,25.84 90 top  (outside the outline)
C18  18.49,109.12 180 top
C19  31.4,80.98 270 top
C20  17.88,104.53 270 top
C21  21.61,99.16 180 top
C22  37.39,59.74 0 top
C23  37.91,45.21 90 top
C24  33.31,48.3 180 top
C25  38.2,111.15 0 top
C26  7.32,56.49 90 top
C27  36.58,107.29 0 top
C28  34.23,79.35 270 top
C29  44.56,70.78 270 top
C30  13.18,39.07 270 bottom
C31  20.73,39.42 180 bottom
C32  20.73,37.29 180 bottom
C33  20.73,35.15 180 bottom
C34  20.73,33.02 180 bottom
C35  11.58,27.23 270 bottom
C36  13.82,27.23 270 bottom
C37  16.05,27.23 270 bottom
C38  18.29,27.23 270 bottom
C39  20.52,27.23 270 bottom
C40  22.76,27.23 270 bottom
C41  14.22,44.91 270 top
C42  14.22,41.66 270 top
C43  7.72,36.17 90 top
C44  7.72,39.42 270 top
C45  38.56,62.99 180 top
C46  14.22,106.16 90 top
C47  12.19,58.32 270 top
C48  41.66,106.88 270 top
C49  39.42,106.88 270 top
C50  30.68,103.23 90 top
C51  34.14,103.43 90 top
C52  56.49,9.35 270 bottom  (outside the outline)
C53  59.33,8.74 270 bottom  (outside the outline)
IC1  39.01,4.85 180 top
IC2  4.06,4.85 180 top
IC3  11.43,4.85 180 top
IC4  31.24,4.85 180 top
LED1  4.06,14.05 90 top
R1  58.12,18.08 180 top  (outside the outline)
R2  54.66,18.08 0 top  (outside the outline)
R5  19.51,77.01 270 top
R6  28.45,41.45 90 top
R7  1.75,13.94 270 top
R8  38,56.08 180 top
R9  37.8,54.05 0 top
R10  32.55,45.37 270 top
R15  17.64,42.04 0 bottom
R16  14.96,35.67 180 top
R17  15.38,39.07 90 bottom
S1  19.91,2.03 180 top
TP1  26.62,101.8 0 top
TP2  26.01,98.15 0 top
TP3  22.56,97.13 0 top
TP5  56.7,43.76 270 top  (outside the outline)
TP6  61.02,44.37 270 top  (outside the outline)
TP7  14.94,31.32 0 bottom
TP8  11.96,31.32 0 bottom
TP13  26.57,2.03 0 top
U$1  57.63,53.35 90 top  (outside the outline)
U$2  23.83,78.13 90 top
U$3  30.07,70.53 0 top
U$4  38.4,70.03 270 top
U$5  56.5,21.93 180 top  (outside the outline)
U$6  21.65,103.53 90 top
U$7  33.02,56.59 0 top
U$8  35.36,45.1 180 top
U$9  2.51,48.84 90 top
U$10  37.41,78.23 90 top
U$11  23.27,36.34 180 top
U$12  7.72,43.28 0 top
U$13  10.9,37.89 90 top
U$14  10.59,49.33 90 top
U$15  36.15,38.03 270 top
U$16  51.82,9.35 90 top  (outside the outline)
U$17  38.87,101.6 180 top
U$18  15.85,35.56 270 bottom
X3  4.39,28.92 0 top

### Tracks (layer width: path | path; a pad name or v marks a point on that pad's centre or on a via)
1.2V  (via drill 0.33 pad 0.15, 0.41)  (1 unrouted)
  Top 0.152: 23.01,41.48 23.11,41.48 v23.11,40.95 | v23.02,32.21 23.02,31.55 23.02,31.31 23.01,31.3 U$11.P$56 23.02,30.46 23.02,30.07 v23.37,29.67 | IC4.3 29.67,9.12 29.67,29.67 v27.64,29.67
  Bottom 0.152: v23.11,40.95 23.11,39.41 C31.2 C32.2 C33.2 C34.2 21.58,32.22 21.58,32.21 22.61,32.21 v23.02,32.21 | v27.64,29.67 v23.37,29.67
3.0V  (3 unrouted)
3.3V  (via drill 0.33 pad 0.15, 0.41)  (52 unrouted)
  Top 0.152: v21.64,27.19 21.64,29.52 22.02,29.52 U$11.P$54 22.02,31.09 21.58,31.6 19.87,31.6 19.87,35.59 | 19.87,35.59 U$11.P$42 | 19.87,38.09 U$11.P$37 18.49,38.09 v18.49,39.88 | 19.87,38.09 19.87,35.59 | 19.87,38.09 19.87,40.35 22.52,40.35 | v38.1,58.5 U$7.P$8 | IC2.3 v1.75,10.36 R7.2 | U$11.P$2 29.5,33.09 30.89,31.7 | 30.89,31.7 v30.89,31.09 | U$11.P$11 30.08,37.59 30.89,36.78 30.89,31.7 | U$15.P$16 37.6,42.48 37.19,42.06 v37.19,37.39
  Bottom 0.152: 9.07,26.44 9.07,14.61 5.49,14.61 1.75,10.87 v1.75,10.36 | 9.07,26.44 11.58,26.44 C35.2 C36.2 C37.2 C38.2 C39.2 21.13,26.38 | 21.64,26.38 C40.2 23.41,27.03 26.82,27.03 v30.89,31.09 v37.19,37.39 42.27,42.47 42.27,57.51 41.27,58.5 v38.1,58.5 | 21.64,26.38 21.13,26.38 | v21.64,27.19 21.64,26.38 | 0.81,40.64 5.31,40.64 5.69,40.26 5.69,34.75 9.68,30.75 9.68,26.45 9.07,26.44 | v18.49,39.88 15.18,39.88 R17.2 15.38,42.2 16.79,42.21 R15.2 | 20.93,26.18 21.13,26.38
5.0V  (4 unrouted)
ANALOG-OUT-ADXL78  (1 unrouted)
  Top 0.152: 29,35.08 U$11.P$6
ANALOG-OUT-STLM20  (2 unrouted)
  Top 0.152: U$8.P$3 34.15,44.44 | 32.76,44.44 32.56,44.45 R10.2
CS-ADT7310  (1 unrouted)
CS-ADXL362  (1 unrouted)
CS-ENABLE
  Top 0.152: U$15.P$6 32.76,36.12 30.28,38.61 29.01,38.61 U$11.P$13
CS-FXAS  (1 unrouted)
CS-LIS3DH  (1 unrouted)
CS-LPS331  (1 unrouted)
CS-LSGD  (1 unrouted)
CS-LSM9D30-G  (1 unrouted)
CS-LSM303  (1 unrouted)
CT-ADT7310  (1 unrouted)
GND  (via drill 0.33 pad 0.15, 0.41)  (91 unrouted)
  Top 0.152: U$11.P$27 | v22.76,29.26 22.52,29.25 22.52,30.6 U$11.P$55 22.52,31.6 22.46,31.6 v22.37,31.61 | IC1.2 IC1.4 IC4.4 | IC3.4 IC3.2 11.43,9.2 | v10.3,28.08 10.29,26.44 9.07,26.44 9.07,14.61 5.49,14.61 4.06,13.18 | 7.72,37.8 C44.2 | U$11.P$39 18.5,37.09 v18.5,37.1 | IC4.4 30.91,2.03 TP13.P$1 | 30.68,8.11 IC4.2 IC4.4 | 25.75,1.77 TP13.P$1 | v14.5,1.77 IC3.4 | v24.77,0.95 25.53,0.94 TP13.P$1 | U$15.P$4 32.52,38.67 32.52,37.4 U$15.P$5 | 33.47,33.62 U$15.P$8 33.41,33.53 32.11,33.53 31.29,34.34 31.29,36.98 30.19,38.09 U$11.P$12 | C43.2 7.72,37.8 | 7.72,37.8 v6.71,37.8 | U$11.P$27 | U$11.P$27 22.02,41.07 v21.89,40.95 | v38.1,57.23 U$7.P$7 | 4.06,13.18 IC2.2 IC2.4 IC3.4 | LED1.C 3.92,13.04 4.06,13.18 | U$11.P$3 v30.07,33.59 | 22.55,29.06 v22.76,29.26 | 23.16,28.85 v22.76,29.26
  Bottom 0.152: v21.89,40.95 19.88,40.95 C31.1 C32.1 | C32.1 C33.1 C34.1 19.88,31.6 v22.37,31.61 | C40.1 C39.1 C38.1 C37.1 C36.1 C35.1 v10.3,28.08 10.29,30.8 6.1,34.99 6.1,37.8 | v22.76,29.26 C40.1 | 18.92,37.29 18.72,37.3 v18.5,37.1 18.5,37.08 17.07,37.08 17.07,36.78 12.19,36.78 12.19,39.92 C30.1 12.97,40.03 | 18.92,37.29 C32.1 | v14.5,1.77 15.09,1.77 15.09,0.95 v24.77,0.95 | 1.22,41.05 5.49,41.05 6.1,40.44 6.1,37.8 | v6.71,37.8 6.1,37.8 | 18.92,37.29 18.69,37.29 18.69,39.09 14.22,39.09 14.22,39.83 13.01,39.83 | 37.42,71.12 39.5,73.2 39.5,95.71 37.9,97.38 35.56,97.38 | 38.19,69.93 40.69,72.43 40.69,96.8 39.55,98.25 35.56,98.25 | 22.02,41.07 v21.89,40.95 | 22.52,41.6 v21.89,40.95 | 25.77,42.42 25.76,42.42 25.4,42.06 | v38.1,57.23 40.92,57.23 41.86,56.29 41.86,43.28 31.09,32.51 | 31.09,32.51 26.01,27.43 23.41,27.43 C40.1 | v30.07,33.59 31.09,32.51
INT-ADT7310  (1 unrouted)
MISO-A
  Top 0.152: U$11.P$28 21.52,45.74 18.9,48.36 11.07,48.36 U$14.P$4
MISO-B  (via drill 0.41)  (7 unrouted)
  Top 0.152: U$2.P$13 27.01,80.16 27.56,79.61 27.56,73.56 | U$10.P$7 v40.08,78.26 | v39.61,96.91 39.62,96.92 U$17.P$23 U$17.P$22 | v26.42,97.94 24.59,99.77 24.59,102.62 24.17,103.03 | U$14.P$17 4.82,48.77 U$9.P$7
  Bottom 0.152: v35.18,70.53 37.8,70.54 40.08,72.81 v40.08,78.26 40.08,96.24 v39.61,96.91 38.71,97.81 35.56,97.81 35.56,97.94 v26.42,97.94
MOSI-A
  Top 0.152: U$11.P$29 21.02,45.43 18.69,47.75 11.12,47.75 U$14.P$3
MOSI-B  (via drill 0.41)  (7 unrouted)
  Top 0.152: v35.76,69.32 35.76,69.94 36.4,69.94 36.4,70.03 | U$10.P$6 39.37,77.73 39.57,77.66 v41.27,77.66 | U$2.P$12 27.18,79.13 27.18,74.01 | U$17.P$24 40.12,98.68 40.39,98.68 v41.08,97.98 | v26.82,98.75 25.2,100.38 25.2,102.82 24.49,103.53 | U$14.P$18 6.24,47.69 6.1,47.55 6.15,47.75 U$9.P$6
  Bottom 0.152: v35.76,69.32 38.56,69.32 41.27,72.04 v41.27,77.66 41.27,97.36 v41.08,97.98 40.39,98.68 35.56,98.68 35.48,98.75 v26.82,98.75
N$1  (1 unrouted)
N$2  (1 unrouted)
N$3  (1 unrouted)
N$4  (1 unrouted)
N$5  (1 unrouted)
N$6  (1 unrouted)
N$7  (1 unrouted)
N$8  (1 unrouted)
N$9  (1 unrouted)
N$10  (via drill 0.41)
  Top 0.152: U$11.P$38 v16.54,37.59
  Bottom 0.152: v16.54,37.59 16.53,38.22 R17.1 C30.2
N$11
  Top 0.152: U$12.P$2 11.6,41.12 14.26,41.12 C42.2 14.22,38.59 U$11.P$36
N$12
  Top 0.152: U$12.P$1 11.58,45.31 14.22,45.31 C41.1 15.89,45.76 15.89,39.57 17.54,39.57 U$11.P$34
N$13
  Top 0.152: C41.2 C42.1 14.22,42.47 15.44,42.47 15.44,39.09 U$11.P$35
N$14
  Top 0.152: R16.2 13.52,35.67 13.11,36.08 10.9,36.08 | 10.9,36.08 U$13.P$1 | 10.9,36.08 8.78,36.08 8.22,35.52 7.52,35.52 C43.1
N$15  (1 unrouted)
N$16
  Top 0.152: U$11.P$40 16.66,36.59 16.66,36.78 12.79,36.78 12.19,37.38 12.19,40.1 U$13.P$2 9.32,40.09 8.94,40.48 7.52,40.48 C44.1
N$17
  Top 0.152: U$11.P$41 15.81,36.09 R16.1
N$18  (via drill 0.41)
  Top 0.152: U$11.P$32 19.51,42.06 v19.51,42.88
  Bottom 0.152: v19.51,42.88 18.49,42.88 R15.1
N$19  (1 unrouted)
N$20
  Bottom 0.152: 42.32,87.58 42.32,83.52
N$21  (1 unrouted)
N$22  (1 unrouted)
N$23  (via drill 0.33 pad 0.15)
  Top 0.152: 17.65,3.79 S1.3 17.68,3.78 17.68,4.97 v16.08,4.97 | 40.46,4.95 v41.33,4.95 IC1.1 | IC2.1 v6.38,4.95 | IC3.1 v13.74,4.98 | IC4.1 v33.55,4.95
  Bottom 0.152: v6.38,4.95 v13.74,4.98 v16.08,4.97 17.91,4.97 v33.55,4.95 v41.33,4.95
N$24
  Bottom 0.152: 42.01,87.58 42.01,83.31
N$25  (2 unrouted)
N$27
  Top 0.152: LED1.A R7.1
N$28
  Bottom 0.152: 42.62,87.38 42.62,83.52
N$29
  Bottom 0.152: 42.93,87.17 42.93,83.72
N$30
  Bottom 0.152: 41.66,87.17 41.66,83.31
RST_B  (1 unrouted)
SCL-0  (4 unrouted)
SCLK-A  (via drill 0.41)
  Top 0.152: U$11.P$30 20.52,44.91 v18.29,47.14 | v16.46,48.97 11.11,48.97 U$14.P$5
  Bottom 0.152: v18.29,47.14 v16.46,48.97
SCLK-B  (via drill 0.41)  (6 unrouted)
  Top 0.152: U$4.P$4 v37.91,72.57 U$10.P$4 | 26.8,74.37 26.8,78.63 U$2.P$11 25.85,78.56 | 38.63,99.62 U$17.P$21 38.61,99.62 38.61,96.32 v38.14,95.85 | U$6.P$4 22.15,100.99 v26.21,96.93 | U$14.P$16 3.79,46.98 U$9.P$4
  Bottom 0.152: v37.91,72.57 37.03,71.7 38.91,73.58 38.91,95.12 v38.14,95.85 37.03,96.95 35.56,96.95 35.53,96.93 v26.21,96.93
  other vias: 26.01,55.27
SD-CARD-INSERT  (1 unrouted)
  Top 0.152: U$11.P$60 25.02,39.01
SD-CS  (2 unrouted)
  Top 0.152: U$11.P$62 26.02,32.93
SD-MISO  (1 unrouted)
  Top 0.152: 26.49,30.61 U$11.P$63 26.52,38.3
SD-MOSI  (1 unrouted)
  Top 0.152: U$11.P$64 27.03,33.93
SD-SCLK  (1 unrouted)
  Top 0.152: 25.6,36.17 25.6,30.52 U$11.P$61
SDA-0  (4 unrouted)
SPI-ADDR0
  Top 0.152: U$11.P$16 29.93,40.09 32.31,42.47 U$15.P$1
SPI-ADDR1
  Top 0.152: U$11.P$15 30.36,39.59 31.98,41.21 U$15.P$2
SPI-ADDR2
  Top 0.152: U$11.P$14 30.93,39.09 31.77,39.94 U$15.P$3
SPI-ENABLE  (via drill 0.41)
  Top 0.152: U$11.P$31 20.02,44.4 v18.29,46.13 | U$14.P$10 12.16,52.26 v12.19,52.22
  Bottom 0.152: v18.29,46.13 v12.19,52.22
SWCLK
  Top 0.152: U$11.P$52 21.03,28.68 8.64,28.68 8.64,26.87 5,26.87 X3.4
SWDIO
  Top 0.152: U$11.P$51 20.52,29.16 8.23,29.16 8.23,28.38 5,28.38 X3.3
SWO
  Top 0.152: U$11.P$49 19.53,30.61 19.53,30.12 8.15,30.12 8.15,31.36 5,31.36 5,31.37 X3.1
TDI  (1 unrouted)
  Top 0.152: U$11.P$50 20.02,29.64 5.08,29.64 | 5,29.87 X3.2
U1RX  (via drill 0.41)
  Top 0.152: U$11.P$45 v11.96,34.09
  Bottom 0.152: v11.96,34.09 TP8.P$1
U1TX  (via drill 0.41)
  Top 0.152: U$11.P$46 14.94,33.59 v14.94,33.38
  Bottom 0.152: v14.94,33.38 TP7.P$1